# Altium schematic sheet USB 2.0.SchDoc
size A4; SheetNumber: 4; SheetTotal: 6
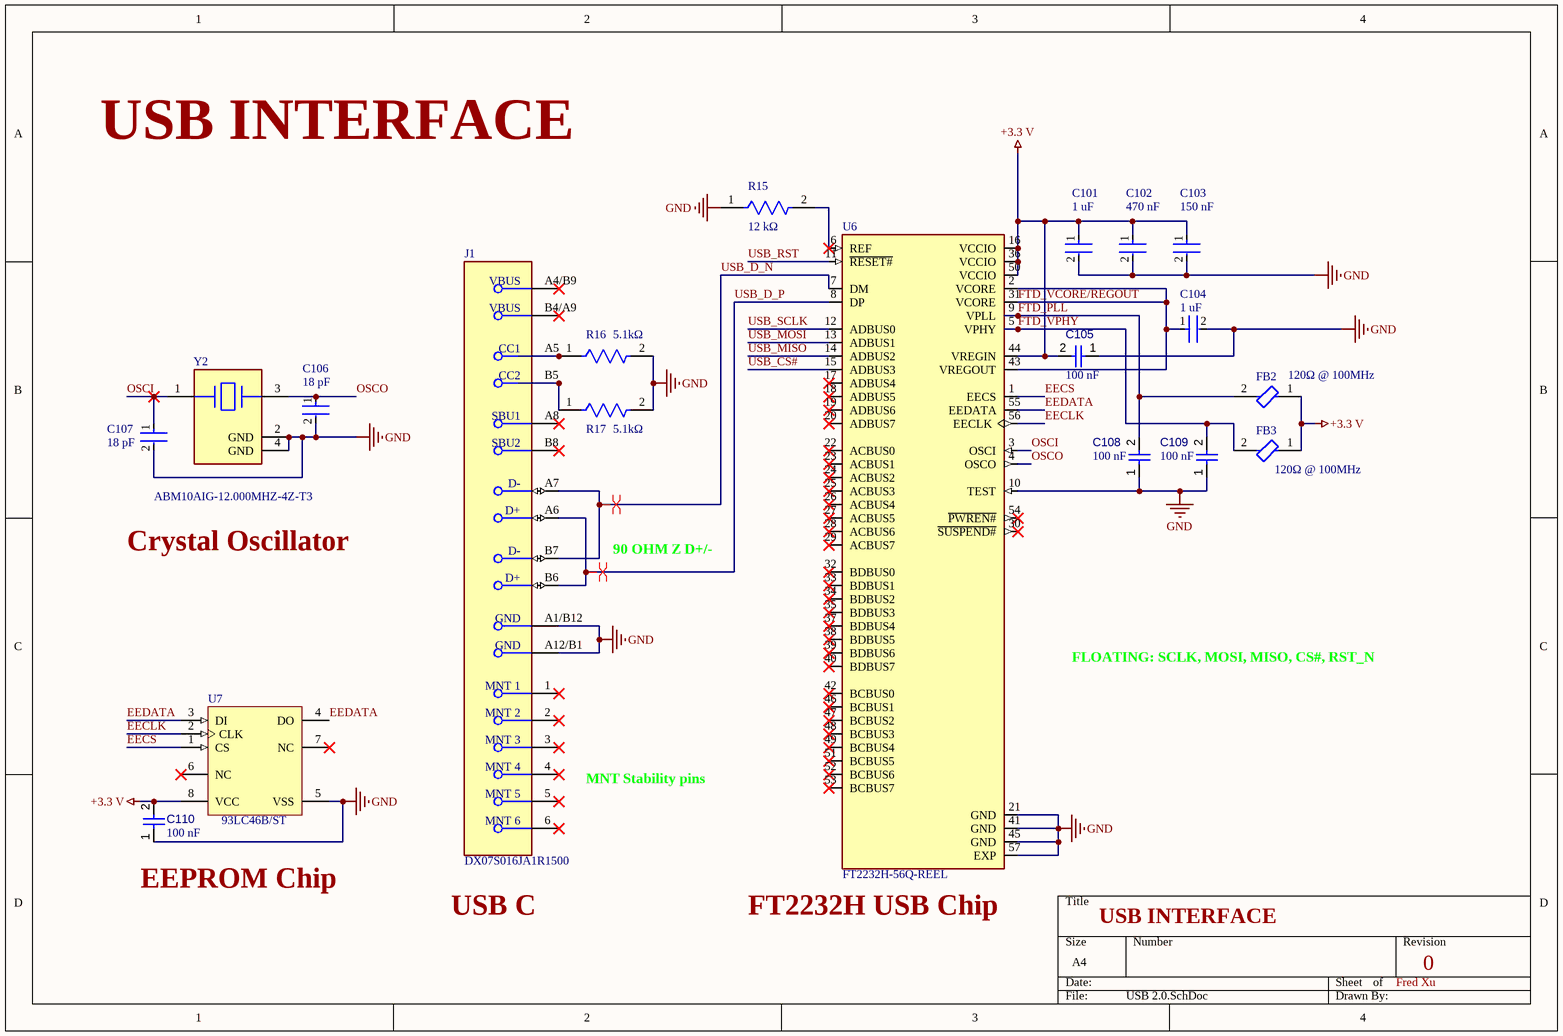
[diagram p0: USB 2.0.SchDoc]

## Parts
C101  1 uF  [FP-GCM155-0_2-MFG]
C102  470 nF  [FP-GRM155-0_05-IPC_B]
C103  150 nF  [FP-GCM155-0_05-MFG]
C104  1 uF  [FP-GCM155-0_2-MFG]
C105  value 100 nF  [CAPC1005X56X25LL10T15]  (hidden comment: 0.1 uF)
C106  18 pF  [FP-CGA2B-IPC_A]
C107  18 pF  [FP-CGA2B-IPC_A]
C108  value 100 nF  [CAPC1005X56X25LL10T15]  (hidden comment: 0.1 uF)
C109  value 100 nF  [CAPC1005X56X25LL10T15]  (hidden comment: 0.1 uF)
C110  value 100 nF  [CAPC1005X56X25LL10T15]  (hidden comment: 0.1 uF)
FB2  120Ω @ 100MHz  [FP-BLM15-0_05-IPC_B]
FB3  120Ω @ 100MHz  [FP-BLM15-0_05-IPC_B]
J1  DX07S016JA1R1500  [FP-DX07S016JA1R1500-MFG]
R15  12 kΩ  [FP-CRGCQ0603-IPC_C]
R16  5.1kΩ  [FP-RN73R1E-IPC_C]
R17  5.1kΩ  [FP-RN73R1E-IPC_C]
U6  FT2232H-56Q-REEL  [QFN50P800X800X100-57N]
U7  93LC46B/ST  [TSSOP-ST8_M]
Y2  ABM10AIG-12.000MHZ-4Z-T3  [FP-ABM10AIG-MFG]

## Nets
+3.3 V: C101.1 C102.1 C103.1 C105.2 C110.2 FB2.1 FB3.1 U6.16(VCCIO) U6.36(VCCIO) U6.44(VREGIN) U6.50(VCCIO) U7.8(VCC)
GND: C101.2 C102.2 C103.2 C104.2 C105.1 C106.2 C107.2 C108.1 C109.1 C110.1 J1.A1/B12(GND) J1.A12/B1(GND) R15.1 R16.2 R17.2 U6.10(TEST) U6.21(GND) U6.41(GND) U6.45(GND) U6.57(EXP) U7.5(VSS) Y2.2(GND) Y2.4(GND)
EECLK: U6.56(EECLK) U7.2(CLK)
EECS: U6.1(EECS) U7.1(CS)
EEDATA: U6.55(EEDATA) U7.3(DI) U7.4(DO)
FTD_PLL: C108.2 FB2.2 U6.9(VPLL)
FTD_VCORE/REGOUT: C104.1 U6.2(VCORE) U6.31(VCORE) U6.43(VREGOUT)
FTD_VPHY: C109.2 FB3.2 U6.5(VPHY)
OSCI: C107.1 U6.3(OSCI) Y2.1(1_Crystal)
OSCO: C106.1 U6.4(OSCO) Y2.3(2_Crystal)
USB_CS#: U6.15(ADBUS3)
USB_D_N: J1.A7(D-) J1.B7(D-) U6.7(DM)
USB_D_P: J1.A6(D+) J1.B6(D+) U6.8(DP)
USB_MISO: U6.14(ADBUS2)
USB_MOSI: U6.13(ADBUS1)
USB_RST: U6.11(~{RESET#})
USB_SCLK: U6.12(ADBUS0)
NetJ1_A5: J1.A5(CC1) R16.1
NetJ1_B5: J1.B5(CC2) R17.1
NetR15_2: R15.2 U6.6(REF)

Not connected (* = marked no-connect by the designer): J1 1(MNT_1)* 2(MNT_2)* 3(MNT_3)* 4(MNT_4)* 5(MNT_5)* 6(MNT_6)* A4/B9(VBUS)* A8(SBU1)* B4/A9(VBUS)* B8(SBU2)*; U6 17(ADBUS4)* 18(ADBUS5)* 19(ADBUS6)* 20(ADBUS7)* 22(ACBUS0)* 23(ACBUS1)* 24(ACBUS2)* 25(ACBUS3)* 26(ACBUS4)* 27(ACBUS5)* 28(ACBUS6)* 29(ACBUS7)* 30(~{SUSPEND#})* 32(BDBUS0)* 33(BDBUS1)* 34(BDBUS2)* 35(BDBUS3)* 37(BDBUS4)* 38(BDBUS5)* 39(BDBUS6)* 40(BDBUS7)* 42(BCBUS0)* 46(BCBUS1)* 47(BCBUS2)* 48(BCBUS3)* 49(BCBUS4)* 51(BCBUS5)* 52(BCBUS6)* 53(BCBUS7)* 54(~{PWREN#})*; U7 6(NC)* 7(NC)*

## Layout directives
differential pair: USB_D_N, USB_D_P

## Notes on the sheet
- USB INTERFACE
- Crystal Oscillator
- 90 OHM Z D+/-
- FLOATING: SCLK, MOSI, MISO, CS#, RST_N
- MNT Stability pins
- (near C110) EEPROM Chip
- USB C
- (near U6) FT2232H USB Chip
- Fred Xu
- 0

## Library data of the parts
C101 C104 = CMP-06035-019453-1: Ceramic Capacitor for Automotive 1uF ±20% 10VDC X7S 0402 Paper T/R
C102 = CMP-06035-008909-1: Chip Multilayer Ceramic Capacitors for General Purpose, 0402, 0.47uF, X7R, 15%, 20%, 10V; Capacitance: 470nF; Length: 1mm; Thickness: 500um; Dielectric: X7R; Voltage Rating (DC): 10V; Width: 500um; Tolerance: 20%
C103 = CMP-06035-038659-1: Ceramic Capacitor for Automotive 150nF ±20% 16VDC X7R 0402 Paper T/R
C105 C108-C110 = CMP-001-00001-6: Chip Capacitor, 0.1 uF, +/- 5%, 16 V, 0402 (1005 Metric); Capacitor Type: Ceramic; Voltage Rating: 16V; Max Operating Temperature: 125°C; Min Operating Temperature: -55°C; Case/Package: 0402; Mounting Technology: SM; Pins: 2; Tolerance: 5%; RoHS Compliant: True
C106 C107 = CMP-08246-001740-1: Cap Ceramic 18pF 50V C0G 5% Pad SMD 0402 +125°C Automotive T/R; Case Code (Imperial): 0402; Capacitance: 18pF; Thickness: 0.022inch; Voltage Rating (DC): 50V; Max Operating Temperature: 125°C; Termination: SMD/SMT; Packaging: Tape and Reel; Case/Package: 0402; Depth: 0.5mm; Width: 0.02inch; Case Code (Metric): 1005; Mount: Surface Mount; Length: 1mm; Composition: Ceramic; Dielectric: C0G; Height: 0.5mm; Min Operating Temperature: -55°C; Voltage Rating: 50V; Weight: 2.3E-05oz; REACH SVHC: No SVHC; Ratings: AEC-Q200; Tolerance: 5%; Package Quantity: 10000
FB2 FB3 = CMP-0686-00281-4: Chip Ferrite Bead, 0402, 120Ω @ 100MHz, 0.09Ω, 25%, 1.3A; Impedance: 120R; Material: Steel; Number of Lines: 1; DC Resistance (DCR): 90mR; Number of Pins: 2; Military Standard: Not; Width: 0.5mm; Depth: 0.55mm; Lead Free: Lead Free; Test Frequency: 100MHz; Case Code (Metric): 1005; Case Code (Imperial): 0402; Current Rating: 1.3A; Package Quantity: 1; Height: 0.5mm; Radiation Hardening: No; Tolerance: 25%; Max DC Current: 1.3A; Packaging: Tape and Reel; REACH SVHC: No SVHC; Case/Package: 0402; Min Operating Temperature: -55°C; Max Current Rating: 1.3A; Length: 1mm; Number of Circuits: 1; Core Material: Ferrite; Max Operating Temperature: 125°C; Termination: SMD/SMT; DC Current: 1.3A
J1 = CMP-19038-000003-1: CONN RCP USB2.0 TYP C 24P SMD RA
R15 = CMP-03211-000309-1: CRGCQ0603 12KΩ 1% ±100ppm/°C 75V; Manufacturer Part Number: CRGCQ0603F12K; Manufacturer: TE Connectivity; Tolerance: 0.01; Power Rating: 0.1W; RoHS: TRUE; Device Class L1: Passive Components; Value: 12KΩ; Package: CRGCQ0603; Voltage Rating: 75V; Ipc Land Pattern Name: RESC16080X45; Octopart: https://octopart.com/crgcq0603f12k-te+connectivity-91018040; Height: 0.55mm; Temperature Coefficient: ±100ppm/°C; Device Class L3: Chip SMD Resistors; Lead Free: Yes; ComponentLink2Description: Datasheet; Series: CRGCQ; ComponentLink2URL: https://www.te.com/commerce/DocumentDelivery/DDEController?Action=showdoc&DocId=Data+Sheet%7F1773204-3%7F1%7Fpdf%7FEnglish%7FENG_DS_1773204-3_1.pdf%7F4-2176339-938; Composition: Thick Film; Resistance: 12KΩ; Ambient Temperature Range High: +70°C; Category: Res; Temperature: -55°C to +155°C; Temperature Range Low: -55°C; Temperature Range High: +155°C; Device Class L2: Resistors
R16 R17 = CMP-04015-008529-1: 5.1kΩ ±1% 0.063W, 1/16W Chip Resistor 0402 (1005 Metric) Moisture Resistant Thin Film
U6 = CMP-031-00006-1: USB Bridge, USB to UART,FIFO USB 2.0 UART, FIFO Interface 56-VQFN (8x8); MF: FTDI,; MP: FT2232H-56Q-REEL; Pins: 57; Design Item ID: FT2232H-56Q-REEL; Component Type: Standard; Check_prices: https://www.snapeda.com/parts/FT2232H-56Q-REEL/FTDI/view-part/?ref=eda; Source: FT2232H-56Q-REEL.SchLib; Value: *; SnapEDA_Link: https://www.snapeda.com/parts/FT2232H-56Q-REEL/FTDI/view-part/?ref=snap; Case/Package: VQFN-56 FTDI
U7 = CMP-0162-00467-1: 1K, 64x16-bit, 2.5V Microwire Serial EEPROM, 8-Pin TSSOP, Commercial Temperature; DatasheetVersion: revG, May-2008; PackageDescription: 8-Lead Plastic Thin Shrink Small Outline (ST) - 4.4mm Body [TSSOP]; Code_JEDEC: MO-153; PackageVersion: revBB, Aug-2009; PackageReference: TSSOP-ST8
Y2 = CMP-27762-011014-1: Crystal 12MHz ±30ppm 10pF SMD-4 2.5mm x 2mm Automotive; Frequency Stability: 50ppm; ESR (Equivalent Series Resistance): 150R; Max Operating Temperature: 125°C; Frequency Tolerance: 30ppm; Frequency: 12MHz; RoHS Compliant: Yes; Mount: Surface Mount; Packaging: Tape and Reel; Case/Package: SMD/SMT; Load Capacitance: 10pF; Min Operating Temperature: -40°C; Length: 0.098inch; Height: 0.024inch; Width: 0.079inch; Ratings: AEC-Q200